# Altium schematic sheet Seq.SchDoc
size A3; SheetNumber: 1; SheetTotal: 2
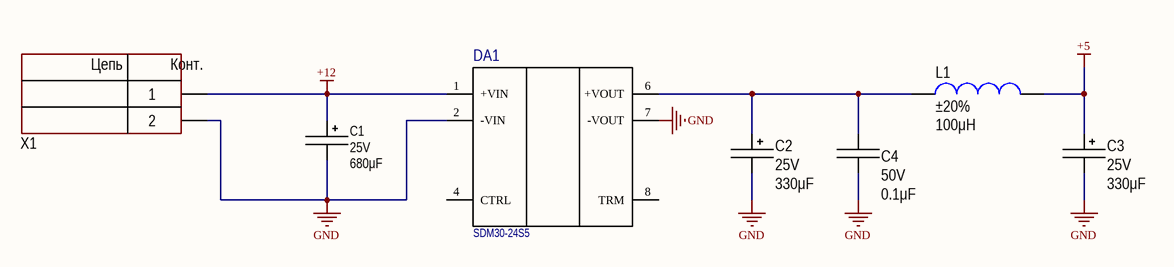
[diagram p0: Seq.SchDoc]

## Parts
C1  value 680μF  Voltage: 25V  [CAP: D10C5H16]
C2  value 330μF  Voltage: 25V  [CAP: D6.3C2.5H11]
C3  value 330μF  Voltage: 25V  [CAP: D6.3C2.5H11]
C4  value 0.1μF  Voltage: 50V  [CAP: 1206]
DA1  SDM30-24S5  [SDM3024S5]
L1  value 100μH  Tolerance: ±20%  [SRR1208-101YL]
X1  (no value)  [2EDGR-5.08-02P]

## Nets
+5: C3.1 L1.1
+12: C1.1 DA1.1(+VIN) X1.1
GND: C1.2 C2.2 C3.2 C4.1 DA1.2(-VIN) DA1.7(-VOUT) X1.2
NetC2_1: C2.1 C4.2 DA1.6(+VOUT) L1.2

Not connected (* = marked no-connect by the designer): DA1 4(CTRL) 8(TRM)

## Notes on the sheet
- (in symbol 2EDGR-5.08-02P) Цепь; Конт.

## Library data of the parts
C1 = Aluminium: Manufacturer: Wurth; PartNumber: 860080475013; ValueManufacturerPartNumber: Aluminium capacitor, 680μF, 25V, ±20%, 54mOhm, 14x10x5 mm, -55...+105°C; TypeCapacitor: Aluminium capacitor; Tolerance: ±20%; Impedance: 54mOhm; Package: 14x10x5 mm; HelpURL: https://www.digikey.com/product-detail/en/wurth-electronics-inc/860080475013/732-9029-1-ND/5728972; Temperature: -55...+105°C
C2 C3 = Aluminium: Manufacturer: Wurth; PartNumber: 860080475013; ValueManufacturerPartNumber: Aluminium capacitor, 330μF, 25V, ±20%, 54mOhm, 14x10x5 mm, -55...+105°C; TypeCapacitor: Aluminium capacitor; Tolerance: ±20%; Impedance: 54mOhm; Package: 14x10x5 mm; HelpURL: https://www.digikey.com/product-detail/en/wurth-electronics-inc/860080475013/732-9029-1-ND/5728972; Temperature: -55...+105°C
C4 = Ceramic_1206: Manufacturer: Yageo; PartNumber: CC1206KRX7R9BB104; ValueManufacturerPartNumber: Ceramic capacitor, 0.1μF, X7R, ±10%, 50V, 1206, -55...+125°C; TypeCapacitor: Ceramic capacitor; Tolerance: ±10%; TypeDielectric: X7R; Package: 1206; HelpURL: https://www.digikey.com/product-detail/en/yageo/CC1206KRX7R9BB104/311-1179-1-ND/303089; Temperature: -55...+125°C
DA1 = SDM30-24S5: Power Supply; Manufacturer_Name: Mean Well; Datasheet Link: https://meanwell.hu/userfiles/webshop/products/attachments/SDM30-24S5.pdf; Height: 16mm; Manufacturer_Part_Number: SDM30-24S5
L1 = Inductor_SDR0403: Manufacturer: Bourns; PartNumber: SDR0403-4R7ML; ValueManufacturerPartNumber: Fixed inductor, 100μH, ±20%, SDR0403, 1.7A, -40...+125°C; TypeInductor: Fixed inductor; MaxCurrent: 1.7A; Package: SDR0403; HelpURL: https://www.digikey.com/product-detail/en/bourns-inc/SDR0403-4R7ML/SDR0403-4R7MLCT-ND/2127096; Temperature: -40...+125°C
X1 = 2EDGR-5.08-02P: Manufacturer: Connfly; ValueManufacturerPartNumber: Connector, 6pin, 2.54mm, 500VAC, 3A; PartNumber: PBS-6; TypeConnector: Connector; VoltageMax: 500VAC; Pitch: 2.54mm; CurrentMax: 3A; Multichannel: 6pin; CommentText: "Разъем"; HelpURL: https://www.chipdip.ru/product/pbs-6